# EAGLE schematic buggym2017 (EAGLE 8.0.0)
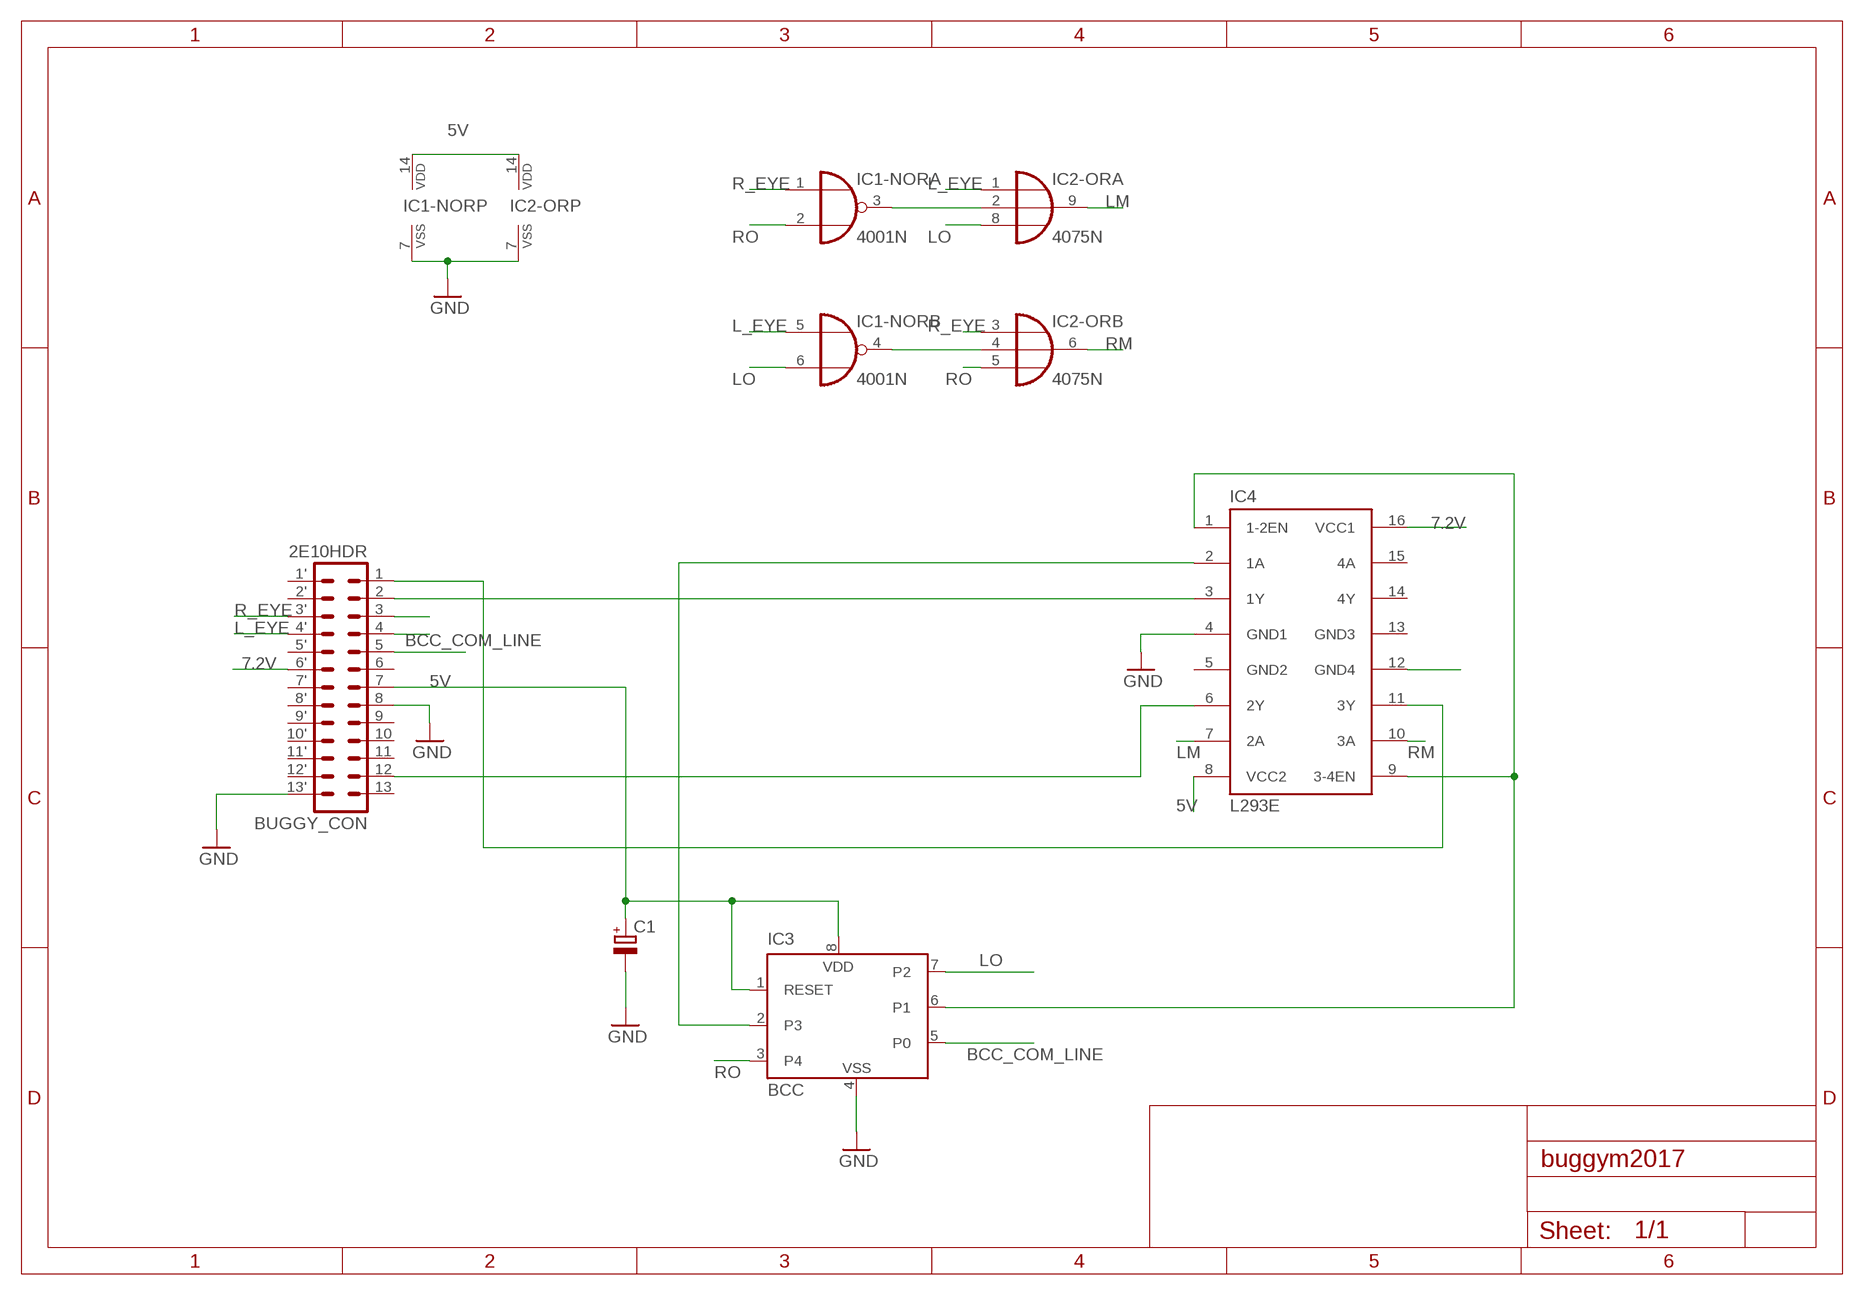
[diagram p0: schematic, sheet 1]

## Parts
BUGGY_CON  2E10HDR  [2E10BOARD]
C1  CPOL-EUE5-4  [E5-4]
IC1-NOR  4001N  [DIL14]
IC2-OR  4075N  [DIL14]
IC3  BCC  [DIL8]
IC4  L293E  [DIL16]

## Nets
5V: BUGGY_CON.7 C1.+ IC1-NOR.14(P:VDD) IC2-OR.14(P:VDD) IC3.1(RESET) IC3.8(5V) IC4.8(VCC2)
7.2V: BUGGY_CON.6' IC4.16(VCC1)
BCC_COM_LINE: BUGGY_CON.5 IC3.5(P0)
GND: BUGGY_CON.8 BUGGY_CON.13' C1.- IC1-NOR.7(P:VSS) IC2-OR.7(P:VSS) IC3.4(VSS) IC4.4(GND1)
L_EYE: BUGGY_CON.4 BUGGY_CON.4' IC1-NOR.5(B:I0) IC2-OR.1(A:I0)
LINK_1: IC1-NOR.3(A:O) IC2-OR.2(A:I1)
LINK_2: IC1-NOR.4(B:O) IC2-OR.4(B:I1)
LM: IC2-OR.9(A:O) IC4.7(2A)
LO: IC1-NOR.6(B:I1) IC2-OR.8(A:I2) IC3.7(P2)
N$2: IC3.2(P3) IC4.2(1A)
N$3: BUGGY_CON.1 IC4.11(3Y)
N$5: BUGGY_CON.12 IC4.6(2Y)
N$6: BUGGY_CON.2 IC4.3(1Y)
N$7: IC4.12(GND4)
N$9: IC3.6(P1) IC4.1(1-2EN) IC4.9(3-4EN)
R_EYE: BUGGY_CON.3 BUGGY_CON.3' IC1-NOR.1(A:I0) IC2-OR.3(B:I0)
RM: IC2-OR.6(B:O) IC4.10(3A)
RO: IC1-NOR.2(A:I1) IC2-OR.5(B:I2) IC3.3(P4)
Unconnected: BUGGY_CON.1' BUGGY_CON.2' BUGGY_CON.5' BUGGY_CON.6 BUGGY_CON.7' BUGGY_CON.8' BUGGY_CON.9 BUGGY_CON.9' BUGGY_CON.10 BUGGY_CON.10' BUGGY_CON.11 BUGGY_CON.11' BUGGY_CON.12' BUGGY_CON.13 IC1-NOR.8(C:I0) IC1-NOR.9(C:I1) IC1-NOR.10(C:O) IC1-NOR.11(D:O) IC1-NOR.12(D:I0) IC1-NOR.13(D:I1) IC2-OR.10(C:O) IC2-OR.11(C:I0) IC2-OR.12(C:I1) IC2-OR.13(C:I2) IC4.14(4Y) IC4.15(4A)

## Power pins joined to a net without a drawn wire
GND2: IC4.5(GND2)
GND3: IC4.13(GND3)

## Library data of the parts
BUGGY_CON = 2E10:2E10HDR
C1 = rcl:CPOL-EU: POLARIZED CAPACITOR, European symbol
IC1-NOR = 40xx:4001: Quad 2-input NOR
IC2-OR = 40xx:4075: Triple 3-input OR
IC3 = shane1:BCC
IC4 = texas:L293E: TI DEVICE; MF: Arrow Electronics; MPN: L293E; OC_FARNELL: 1467711; OC_NEWARK: 89K0732